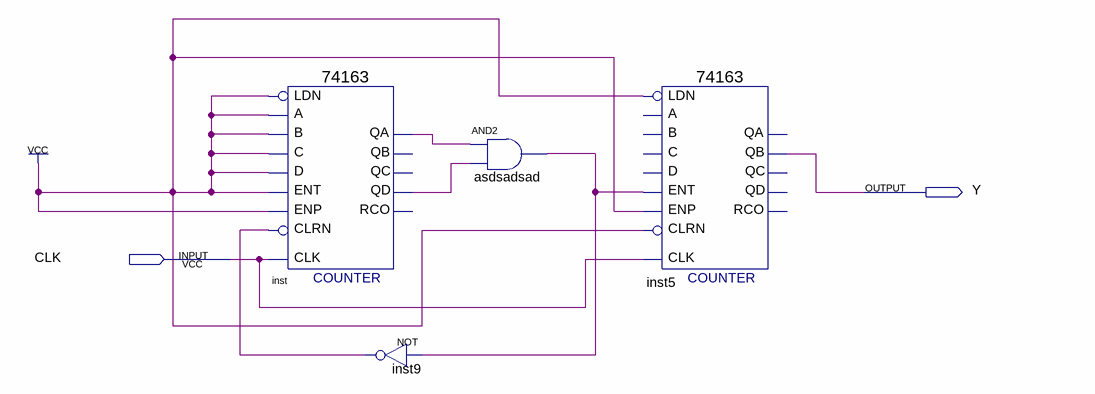
[diagram p0: schematic sheet]
// Quartus schematic p3.bdf as structural Verilog: 4 symbols, 2 pins
module p3 (
  input  CLK,
  output Y
);

  wire asdsadsad_out, inst9_out, inst_qa, inst_qd;

  \74163  inst (
    .C(1'b1), .B(1'b1), .A(1'b1), .ENT(1'b1), .D(1'b1), .CLRN(inst9_out), .CLK(CLK), .ENP(1'b1), .LDN(1'b1),
    .QA(inst_qa), .QD(inst_qd));  // open: QB, QC, RCO
  not inst9 (inst9_out, asdsadsad_out);
  and asdsadsad (asdsadsad_out, inst_qa, inst_qd);
  \74163  inst5 (
    .ENT(asdsadsad_out), .CLRN(1'b1), .CLK(CLK), .ENP(1'b1), .LDN(1'b1), .QB(Y));  // open: C, B, A, D, QA, QC, QD, RCO
endmodule
